# Altium schematic sheet MOSFET_Driver_Sheet3.SchDoc
size 420 x 297 mm; SheetNumber: 24; SheetTotal: 32
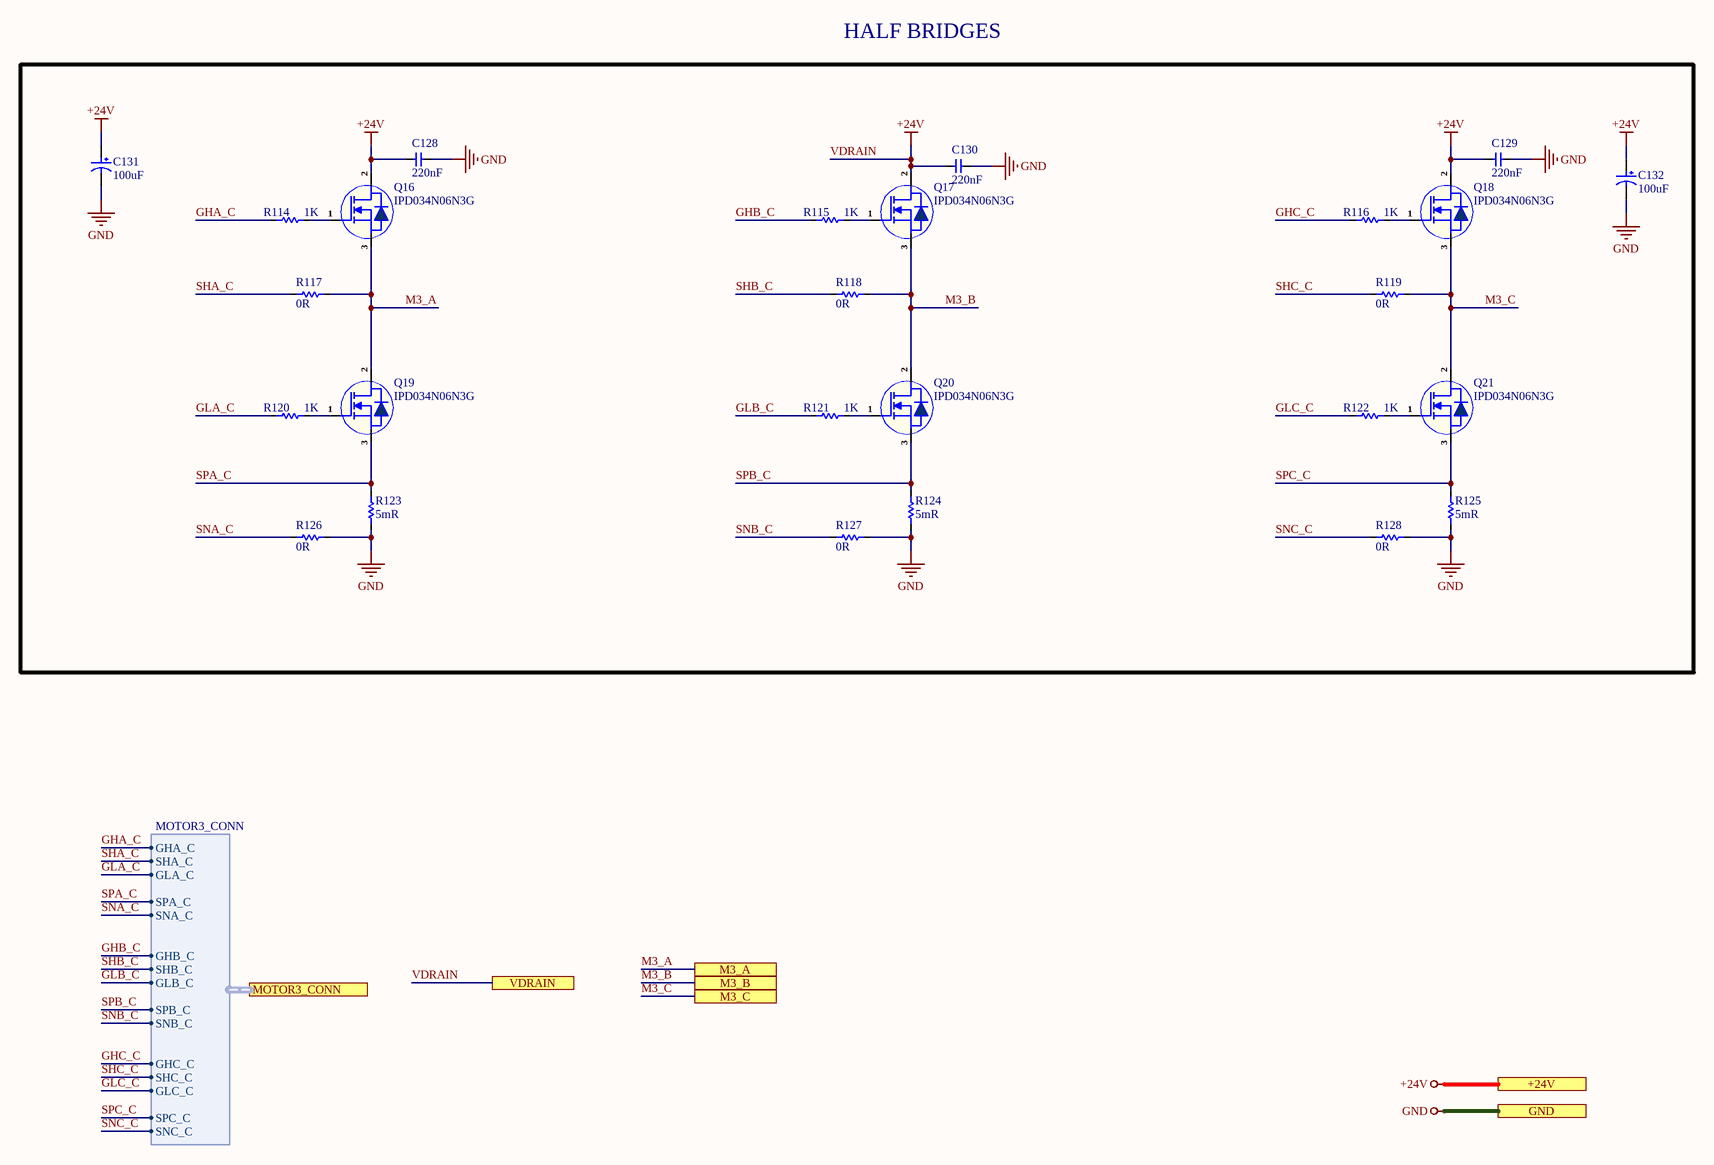
[diagram p0: MOSFET_Driver_Sheet3.SchDoc]

## Parts
C128  220nF  [Cap-0805]
C129  220nF  [Cap-0805]
C130  220nF  [Cap-0805]
C131  100uF  [RVT1A101M0605]
C132  100uF  [RVT1A101M0605]
Q16  IPD034N06N3G  [TO-252-2L]
Q17  IPD034N06N3G  [TO-252-2L]
Q18  IPD034N06N3G  [TO-252-2L]
Q19  IPD034N06N3G  [TO-252-2L]
Q20  IPD034N06N3G  [TO-252-2L]
Q21  IPD034N06N3G  [TO-252-2L]
R114  1K  [Res-0402]
R115  1K  [Res-0402]
R116  1K  [Res-0402]
R117  0R  [Res-0603]
R118  0R  [Res-0603]
R119  0R  [Res-0603]
R120  1K  [Res-0402]
R121  1K  [Res-0402]
R122  1K  [Res-0402]
R123  5mR  [Res-1206]
R124  5mR  [Res-1206]
R125  5mR  [Res-1206]
R126  0R  [Res-0603]
R127  0R  [Res-0603]
R128  0R  [Res-0603]

## Ports
+24V (see Servo3[4A], Connector_Sheet[5D], DIO_1[5D], DIO_2[5D], DIO_3[5D], DIO_4[5D], MOSFET_Driver_Sheet1[5D], MOSFET_Driver_Sheet2[5D], MOSFET_Driver_Sheet4[5D], Motor_Driver_Sheet1[5D], Motor_Driver_Sheet2[5D], Motor_Driver_Sheet3[5D], Motor_Driver_Sheet4[5D], Power_Sheet[5D]), GND (see Servo3[4B], CAN_Sheet[5D], Connector_Sheet[5D], Controller_Sheet[5D], DIO_1[5D], DIO_2[5D], DIO_3[5D], DIO_4[5D], Encoder_Sheet1[5D], Encoder_Sheet2[5D], Encoder_Sheet3[5D], Encoder_Sheet4[5D], EtherCAT_Sheet[5D], MOSFET_Driver_Sheet1[5D], MOSFET_Driver_Sheet2[5D], MOSFET_Driver_Sheet4[5D], Motor_Driver_Sheet1[5D], Motor_Driver_Sheet2[5D], Motor_Driver_Sheet3[5D], Motor_Driver_Sheet4[5D], Power_Sheet[5D], RJ45_Sheet[5D], RS485_RS232_Sheet[3D], Sec_Controller_Sheet1[5D], Sec_Controller_Sheet2[5D], Sec_Controller_Sheet3[5D], Sec_Controller_Sheet4[5D]), M3_A (see Servo3[5B], Connector_Sheet[4D], Servo3[5B]), M3_B (see Servo3[5B], Connector_Sheet[4D], Servo3[5B]), M3_C (see Servo3[5B], Connector_Sheet[4D], Servo3[5B]), MOTOR3_CONN (harness MOTOR3_CONN, see Servo3[4B], Motor_Driver_Sheet3[2D]), VDRAIN (see Servo3[4B], MOSFET_Driver_Sheet1[2D], MOSFET_Driver_Sheet2[2D], MOSFET_Driver_Sheet4[2D], Motor_Driver_Sheet1[2D], Motor_Driver_Sheet2[2D], Motor_Driver_Sheet3[2D], Motor_Driver_Sheet4[2D])

## Harnesses
MOTOR3_CONN: GHA_C, SHA_C, GLA_C, SPA_C, SNA_C, GHB_C, SHB_C, GLB_C, SPB_C, SNB_C, GHC_C, SHC_C, GLC_C, SPC_C, SNC_C

## Nets
GND: C128.1 C129.1 C130.1 C131.2 C132.2 R123.1 R124.1 R125.1 R126.1 R127.1 R128.1 ; port GND
VDRAIN: C128.2 C129.2 C130.2 C131.1 C132.1 Q16.2(D) Q17.2(D) Q18.2(D) ; port +24V, port VDRAIN  [also labelled +24V]
GHA_C: R114.1 ; port MOTOR3_CONN.GHA_C
GHB_C: R115.1 ; port MOTOR3_CONN.GHB_C
GHC_C: R116.1 ; port MOTOR3_CONN.GHC_C
GLA_C: R120.1 ; port MOTOR3_CONN.GLA_C
GLB_C: R121.1 ; port MOTOR3_CONN.GLB_C
GLC_C: R122.1 ; port MOTOR3_CONN.GLC_C
M3_A: Q16.3(S) Q19.2(D) R117.1 ; port M3_A
M3_B: Q17.3(S) Q20.2(D) R118.1 ; port M3_B
M3_C: Q18.3(S) Q21.2(D) R119.1 ; port M3_C
SHA_C: R117.2 ; port MOTOR3_CONN.SHA_C
SHB_C: R118.2 ; port MOTOR3_CONN.SHB_C
SHC_C: R119.2 ; port MOTOR3_CONN.SHC_C
SNA_C: R126.2 ; port MOTOR3_CONN.SNA_C
SNB_C: R127.2 ; port MOTOR3_CONN.SNB_C
SNC_C: R128.2 ; port MOTOR3_CONN.SNC_C
SPA_C: Q19.3(S) R123.2 ; port MOTOR3_CONN.SPA_C
SPB_C: Q20.3(S) R124.2 ; port MOTOR3_CONN.SPB_C
SPC_C: Q21.3(S) R125.2 ; port MOTOR3_CONN.SPC_C
NetQ16_1: Q16.1(G) R114.2
NetQ17_1: Q17.1(G) R115.2
NetQ18_1: Q18.1(G) R116.2
NetQ19_1: Q19.1(G) R120.2
NetQ20_1: Q20.1(G) R121.2
NetQ21_1: Q21.1(G) R122.2

## Notes on the sheet
- HALF BRIDGES
- File:
- Title:
- Date:
- Page
- Num:
- Total:
- Drawn By: Huzaifa Ali

## Library data of the parts
C128-C130 = 08051C224K4T2A: CAP CER 0.22UF 100V X7R 0805; Manufacturer: Kyocera AVX; Tolerance: 10%; Item Type: Capacitor; Supplier 1: Digi-Key; Manufacturer Part Number: 08051C224K4T2A; RoHS: Yes; Category: Ceramic Capacitors; Stock 1: 151; Pricing 1: 1=0.27000, 10=0.18500, 50=0.12320, 100=0.10470, 500=0.07392, 1000=0.06468 (USD); Mount: Surface Mount; Case/Package: 0805; Contact Plating: Tin; Min Operating Temperature: -55°C; Max Operating Temperature: 125°C; Termination: Wraparound; Capacitance: 220nF; Dielectric: X7R; Voltage Rating (DC): 100V; Length: 2.01mm; RoHS Compliant: Yes; ComponentLink1URL: http://datasheets.avx.com/AutoMLCC.pdf?src-supplier=Avnet+Asia; ComponentLink1Description: http://datasheets.avx.com/AutoMLCC.pdf?src-supplier=Avnet+Asia; Supplier Part Number 1: 478-13049-1-ND; LCSC Part Number: C2176107
C131 C132 = RVT1A101M0605: 100uF 10V 55mA@120Hz ±20% SMD,D6.3xL5.4mm Aluminum Electrolytic Capacitors - SMD ROHS; Manufacturer: ROQANG; Manufacturer Part Number: RVT1A101M0605; Package: SMD,D6.3xL5.4mm; LCSC Part Number: C72474; Item Type: Capacitor; ComponentLink1Description: LCSC; ComponentLink1URL: https://www.lcsc.com/product-detail/Aluminum-Electrolytic-Capacitors-SMD_ROQANG-RVT1A101M0605_C72474.html
Q16-Q21 = IPD034N06N3G: MOSFET N-CH 60V 100A TO252-3; Manufacturer: Infineon; Supplier: Mouser; Supplier Part Number: 726-IPD034N06N3G; Manufacturer Part Number: IPD034N06N3G; RoHS: Yes; Stock: 7587; Pricing: 1=1.76, 10=1.48, 50=1.48, 100=1.2, 1000=0.837, 10000=0.747 (USD); LCSC Part Number: C94897; Item Type: Mosfet
R114-R116 R120-R122 = RC0402FR-071KL: RES 1K OHM 1% 1/16W 0402; Manufacturer: Yageo; Resistance: 1kR; Temperature Coefficient: 100ppm/°C; Voltage Rating (DC): 50V; Power Rating: 62.5mW; Max Power Dissipation: 63mW; Item Type: Resistor; Supplier 1: Avnet; Manufacturer Part Number: RC0402FR-071KL; RoHS: Yes; Category: Chip SMD Resistors; Stock 1: 13030000; Pricing 1: 10000=0.00085, 20000=0.00087, 40000=0.00084, 60000=0.00083, 80000=0.00079, 100000=0.00078, 1000000=0.00076 (USD); Case/Package: 0402; Number of Pins: 2; Case Code (Imperial): 0402; Case Code (Metric): 1005; Size Code: 0402; Min Operating Temperature: -55°C; Max Operating Temperature: 155°C; Resistor Type: Thick Film; Tolerance: 1%; Packaging: Tape and Reel; Voltage Rating: 50V; Termination: SMD/SMT; Features: Moisture Resistant; Series: RC; Number of Terminations: 2; Resistance Tolerance: 1%; Construction: Rectangular; Technology: THICK FILM; Length: 1mm; Width: 0.5mm; Height: 0.32mm; Depth: 0.5mm; Reach SVHC Compliant: Yes; Lead Free: Lead Free; RoHS Compliant: Yes; Military Standard: Not; ComponentLink1URL: https://datasheet.ciiva.com/11819/0900766b80c66297-11819477.pdf?src-supplier=RSComponents; ComponentLink1Description: https://datasheet.ciiva.com/11819/0900766b80c66297-11819477.pdf?src-supplier=RSComponents; ComponentLink2URL: https://datasheet.ciiva.com/7983/1018594-7983502.pdf?src-supplier=Element14; ComponentLink2Description: https://datasheet.ciiva.com/7983/1018594-7983502.pdf?src-supplier=Element14; ComponentLink3URL: https://datasheet.ciiva.com/22747/1018594-22747513.pdf?src-supplier=Element14; ComponentLink3Description: https://datasheet.ciiva.com/22747/1018594-22747513.pdf?src-supplier=Element14; ComponentLink4URL: https://datasheet.ciiva.com/12666/pyu-rc0402-51-rohs-l-6-r-12666741.pdf?src-supplier=Mouser; ComponentLink4Description: https://datasheet.ciiva.com/12666/pyu-rc0402-51-rohs-l-6-r-12666741.pdf?src-supplier=Mouser; ComponentLink5URL: https://datasheet.ciiva.com/7849/1018594-7849869.pdf?src-supplier=Element14; ComponentLink5Description: https://datasheet.ciiva.com/7849/1018594-7849869.pdf?src-supplier=Element14; ComponentLink6URL: https://datasheet.ciiva.com/7849/1018594-7849871.pdf?src-supplier=Element14; ComponentLink6Description: https://datasheet.ciiva.com/7849/1018594-7849871.pdf?src-supplier=Element14; ComponentLink7URL: https://datasheet.ciiva.com/17063/pyu-rc0402-51-rohs-l-6-r-17063193.pdf?src-supplier=Future+Electronics; ComponentLink7Description: https://datasheet.ciiva.com/17063/pyu-rc0402-51-rohs-l-6-r-17063193.pdf?src-supplier=Future+Electronics; Supplier Part Number 1: RC0402FR-071KL; LCSC Part Number: C106235
R117-R119 R126-R128 = RC0603JR-070RL: RES 0 OHM JUMPER 1/10W 0603; Manufacturer: Yageo; Resistance: 0mR; Tolerance: 1%; Power Rating: 100mW; Voltage Rating (DC): 50V; Temperature Coefficient: 200ppm/°C; Resistance Tolerance: 5%; Item Type: Resistor; Supplier 1: Digi-Key; Manufacturer Part Number: RC0603JR-070RL; RoHS: Yes; Category: Chip SMD Resistors; Stock 1: 18081776; Pricing 1: 1=0.10000, 10=0.01700, 25=0.01240, 50=0.00960, 100=0.00700, 250=0.00536, 500=0.00430, 1000=0.00316 (USD); Case/Package: 0603; Number of Pins: 2; Contact Plating: Tin,Matte; Case Code (Imperial): 0603; Case Code (Metric): 1608; Size Code: 0603; Min Operating Temperature: -55°C; Max Operating Temperature: 155°C; Resistor Type: Thick Film; Packaging: Tape and Reel; Termination: SMD/SMT; Series: RC; Technology: THICK FILM; Package Quantity: 5000; Voltage Rating: 50V; Features: Moisture Resistant; Max Power Dissipation: 100mW; Number of Terminations: 2; Construction: Rectangular; Length: 1.6mm; Width: 0.8mm; Height: 0.45mm; Depth: 0.8mm; Radiation Hardening: No; Reach SVHC Compliant: No SVHC; Lead Free: Lead Free; RoHS Compliant: Yes; Military Standard: Not; Supplier Part Number 1: 311-0.0GRCT-ND; LCSC Part Number: C95177
R123-R125 = CUM1206-15FR005: 1W 5mΩ ±1% 1206 Current Sense Resistors/Shunt Resistors ROHS; Manufacturer: FORT; Item Type: Capacitor; Manufacturer Part Number: CUM1206-15FR005; Package: 1206; LCSC Part Number: C5185588; ComponentLink1Description: LCSC; ComponentLink1URL: https://www.lcsc.com/product-detail/Current-Sense-Resistors-Shunt-Resistors_FORT-CUM1206-15FR005_C5185588.html